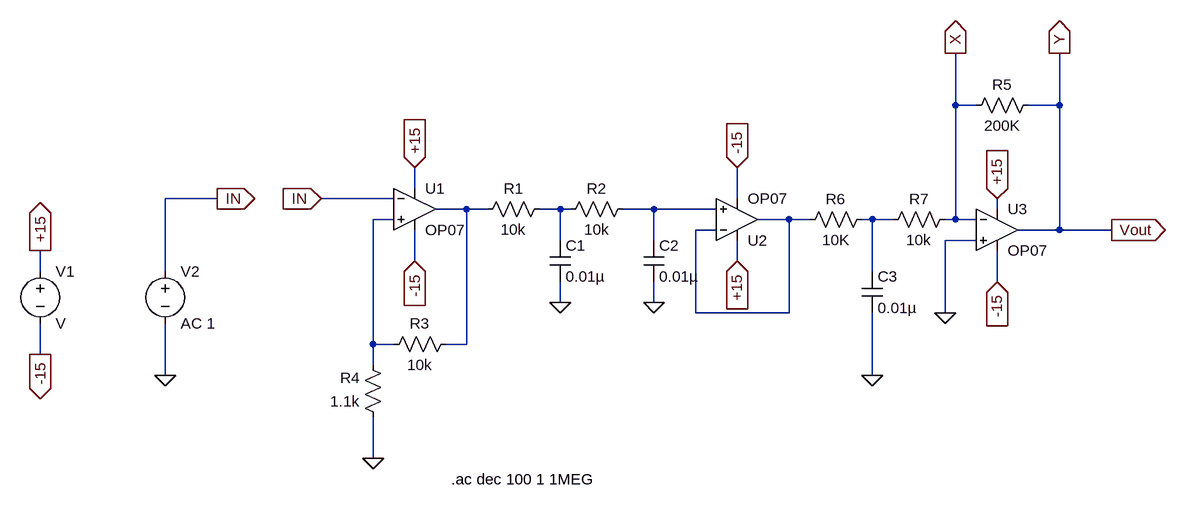
[diagram p0: schematic MultiPoleAmplifier.asc]
MultiPoleAmplifier.asc, the LTspice schematic file:
Version 4
SHEET 1 1396 680
WIRE 976 -16 976 -96
WIRE 1008 -16 976 -16
WIRE 1136 -16 1136 -96
WIRE 1136 -16 1088 -16
WIRE 144 112 144 80
WIRE -160 128 -240 128
WIRE 112 128 0 128
WIRE 640 128 640 80
WIRE 224 144 176 144
WIRE 256 144 224 144
WIRE 368 144 336 144
WIRE 384 144 368 144
WIRE 512 144 464 144
WIRE 608 144 512 144
WIRE 1040 144 1040 128
WIRE 112 160 80 160
WIRE 720 160 672 160
WIRE 752 160 720 160
WIRE 848 160 832 160
WIRE 880 160 848 160
WIRE 976 160 976 -16
WIRE 976 160 960 160
WIRE 1008 160 976 160
WIRE 608 176 576 176
WIRE 1136 176 1136 -16
WIRE 1136 176 1072 176
WIRE 1216 176 1136 176
WIRE 368 192 368 144
WIRE 512 192 512 144
WIRE 1008 192 960 192
WIRE 144 224 144 176
WIRE 640 224 640 192
WIRE -432 240 -432 208
WIRE -240 240 -240 128
WIRE 848 240 848 160
WIRE 1040 256 1040 208
WIRE 368 288 368 256
WIRE 512 288 512 256
WIRE 576 304 576 176
WIRE 720 304 720 160
WIRE 720 304 576 304
WIRE 960 304 960 192
WIRE 80 352 80 160
WIRE 112 352 80 352
WIRE 224 352 224 144
WIRE 224 352 192 352
WIRE -432 368 -432 320
WIRE 80 384 80 352
WIRE -240 400 -240 320
WIRE 848 400 848 304
WIRE 80 528 80 464
FLAG 80 528 0
FLAG 0 128 IN
IOPIN 0 128 In
FLAG 144 224 -15
IOPIN 144 224 In
FLAG 144 80 +15
IOPIN 144 80 In
FLAG 640 224 +15
IOPIN 640 224 In
FLAG 640 80 -15
IOPIN 640 80 In
FLAG 368 288 0
FLAG 512 288 0
FLAG 976 -96 X
IOPIN 976 -96 Out
FLAG 1136 -96 Y
IOPIN 1136 -96 Out
FLAG 960 304 0
FLAG 848 400 0
FLAG 1040 128 +15
IOPIN 1040 128 In
FLAG 1040 256 -15
IOPIN 1040 256 In
FLAG 1216 176 Vout
IOPIN 1216 176 Out
FLAG -432 208 +15
IOPIN -432 208 Out
FLAG -432 368 -15
IOPIN -432 368 Out
FLAG -240 400 0
FLAG -160 128 IN
IOPIN -160 128 Out
SYMBOL Opamps\\OP07 144 80 R0
SYMATTR InstName U1
SYMBOL Opamps\\OP07 640 224 M180
SYMATTR InstName U2
SYMBOL Opamps\\OP07 1040 112 R0
SYMATTR InstName U3
SYMBOL res 352 128 R90
WINDOW 0 0 56 VBottom 2
WINDOW 3 32 56 VTop 2
SYMATTR InstName R1
SYMATTR Value 10k
SYMBOL res 480 128 R90
WINDOW 0 0 56 VBottom 2
WINDOW 3 32 56 VTop 2
SYMATTR InstName R2
SYMATTR Value 10k
SYMBOL cap 352 192 R0
SYMATTR InstName C1
SYMATTR Value 0.01µ
SYMBOL cap 496 192 R0
SYMATTR InstName C2
SYMATTR Value 0.01µ
SYMBOL res 208 336 R90
WINDOW 0 0 56 VBottom 2
WINDOW 3 32 56 VTop 2
SYMATTR InstName R3
SYMATTR Value 10k
SYMBOL res 96 480 R180
WINDOW 0 36 76 Left 2
WINDOW 3 36 40 Left 2
SYMATTR InstName R4
SYMATTR Value 1.1k
SYMBOL res 1104 -32 R90
WINDOW 0 0 56 VBottom 2
WINDOW 3 32 56 VTop 2
SYMATTR InstName R5
SYMATTR Value 200K
SYMBOL res 848 144 R90
WINDOW 0 0 56 VBottom 2
WINDOW 3 32 56 VTop 2
SYMATTR InstName R6
SYMATTR Value 10K
SYMBOL res 976 144 R90
WINDOW 0 0 56 VBottom 2
WINDOW 3 32 56 VTop 2
SYMATTR InstName R7
SYMATTR Value 10k
SYMBOL cap 832 240 R0
SYMATTR InstName C3
SYMATTR Value 0.01µ
SYMBOL voltage -432 224 R0
SYMATTR InstName V1
SYMBOL voltage -240 224 R0
WINDOW 123 0 0 Left 2
WINDOW 39 0 0 Left 2
SYMATTR InstName V2
SYMATTR Value AC 1
TEXT 200 560 Left 2 !.ac dec 100 1 1MEG

The netlist it stands for:
* MultiPoleAmplifier.asc
XU1 N004 IN +15 -15 N001 LT1001  ; OP07, pins In+ In- V+ V- OUT
XU2 N003 N005 +15 -15 N005 LT1001  ; OP07, pins In+ In- V+ V- OUT
XU3 0 X +15 -15 Vout LT1001  ; OP07, pins In+ In- V+ V- OUT
R1 N002 N001 10k
R2 N003 N002 10k
C1 N002 0 0.01µ
C2 N003 0 0.01µ
R3 N001 N004 10k
R4 0 N004 1.1k
R5 Vout X 200K
R6 N006 N005 10K
R7 X N006 10k
C3 N006 0 0.01µ
V1 +15 -15 V
V2 IN 0 AC 1
.ac dec 100 1 1MEG
.lib LTC.lib
.backanno
.end